# EAGLE design Eagle_4-Channel Relay Driver Circuit (EAGLE 9.6.2)
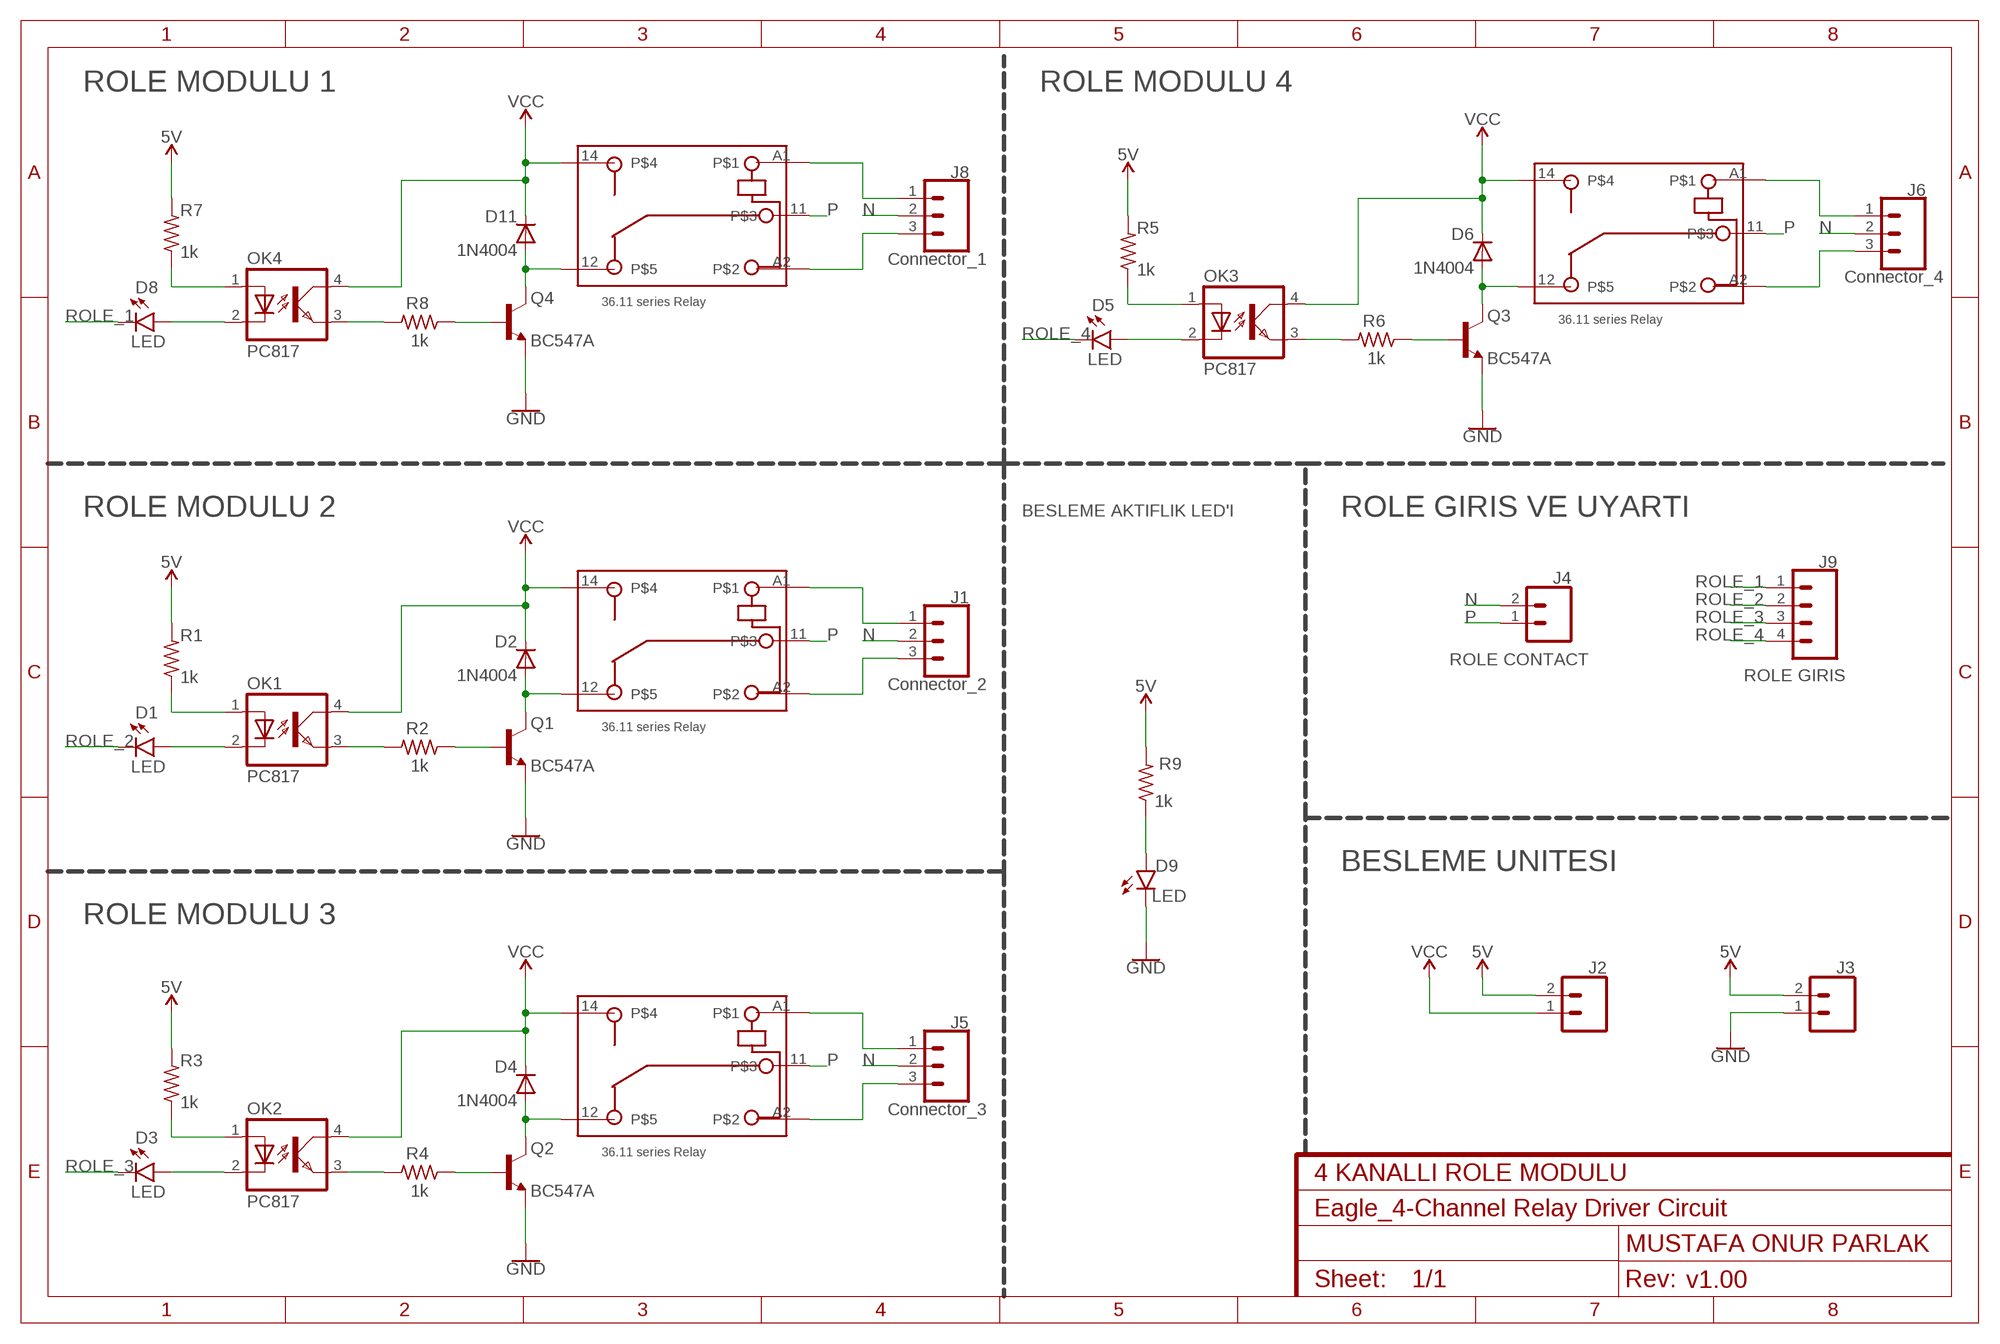
[diagram p0: schematic, sheet 1]
FRAME1 (FRAME-A4L): CNAME: 4 KANALLI ROLE MODULU; CREVISION: v1.00; DESIGNER: MUSTAFA ONUR PARLAK

## Parts
D1  LED  LED3MM  [LED_3MM]
D2  1N4004  [DO41-10]
D3  LED  LED3MM  [LED_3MM]
D4  1N4004  [DO41-10]
D5  LED  LED3MM  [LED_3MM]
D6  1N4004  [DO41-10]
D8  LED  LED3MM  [LED_3MM]
D9  LED  LED3MM  [LED_3MM]
D11  1N4004  [DO41-10]
J1  Connector_2  CONN_03  [1X03]
J2  CONN_02  [1X02]
J3  CONN_02  [1X02]
J4  ROLE CONTACT  CONN_02  [1X02]
J5  Connector_3  CONN_03  [1X03]
J6  Connector_4  CONN_03  [1X03]
J8  Connector_1  CONN_03  [1X03]
J9  ROLE GIRIS  CONN_04PTH  [1X04]
OK1  PC817  [DIL04]
OK2  PC817  [DIL04]
OK3  PC817  [DIL04]
OK4  PC817  [DIL04]
Q1  BC547A  TRANS_NPN-2N3904  [TO-92]
Q2  BC547A  TRANS_NPN-2N3904  [TO-92]
Q3  BC547A  TRANS_NPN-2N3904  [TO-92]
Q4  BC547A  TRANS_NPN-2N3904  [TO-92]
R1  1k  R-US_0207/10  [0207/10]
R2  1k  R-US_0207/10  [0207/10]
R3  1k  R-US_0207/10  [0207/10]
R4  1k  R-US_0207/10  [0207/10]
R5  1k  R-US_0207/10  [0207/10]
R6  1k  R-US_0207/10  [0207/10]
R7  1k  R-US_0207/10  [0207/10]
R8  1k  R-US_0207/10  [0207/10]
R9  1k  R-US_0207/10  [0207/10]
ROLE_1  36.11  [36.11]
ROLE_2  36.11  [36.11]
ROLE_3  36.11  [36.11]
ROLE_4  36.11  [36.11]

## Nets
5V: J2.2 J3.2 R1.2 R3.2 R5.2 R7.2 R9.2
GND: D9.K(C) J3.1 Q1.1(E) Q2.1(E) Q3.1(E) Q4.1(E)
N: J1.2 J4.2 J5.2 J6.2 J8.2
N$1: OK1.1(A) R1.1
N$2: Q1.2(B) R2.1
N$3: D2.A Q1.3(C) ROLE_2.12
N$4: D1.A OK1.2(C)
N$5: OK1.3(EMIT) R2.2
N$6: J1.1 ROLE_2.A1
N$7: J1.3 ROLE_2.A2
N$8: OK2.1(A) R3.1
N$9: Q2.2(B) R4.1
N$10: D4.A Q2.3(C) ROLE_3.12
N$11: D3.A OK2.2(C)
N$12: OK2.3(EMIT) R4.2
N$13: J5.1 ROLE_3.A1
N$14: J5.3 ROLE_3.A2
N$15: OK3.1(A) R5.1
N$16: Q3.2(B) R6.1
N$17: D6.A Q3.3(C) ROLE_4.12
N$18: D5.A OK3.2(C)
N$19: OK3.3(EMIT) R6.2
N$20: J6.1 ROLE_4.A1
N$21: J6.3 ROLE_4.A2
N$22: OK4.1(A) R7.1
N$23: Q4.2(B) R8.1
N$24: D11.A Q4.3(C) ROLE_1.12
N$25: D8.A OK4.2(C)
N$26: OK4.3(EMIT) R8.2
N$27: J8.1 ROLE_1.A1
N$28: J8.3 ROLE_1.A2
N$29: D9.A R9.1
P: J4.1 ROLE_1.11 ROLE_2.11 ROLE_3.11 ROLE_4.11
ROLE_1: D8.K(C) J9.1
ROLE_2: D1.K(C) J9.2
ROLE_3: D3.K(C) J9.3
ROLE_4: D5.K(C) J9.4
VCC: D2.C D4.C D6.C D11.C J2.1 OK1.4(COL) OK2.4(COL) OK3.4(COL) OK4.4(COL) ROLE_1.14 ROLE_2.14 ROLE_3.14 ROLE_4.14

## Notes on the sheet
- ROLE MODULU 1 | ROLE MODULU 4
- ROLE MODULU 2 | BESLEME AKTIFLIK LED'I | ROLE GIRIS VE UYARTI
- BESLEME UNITESI
- ROLE MODULU 3

## Library data of the parts
D1 D3 D5 D8 D9 = SparkFun-LED:LED: LED (Generic) Standard schematic elements and footprints for 5mm, 3mm, 1206, and 0603 sized LEDs. Generic LEDs with no color specified.; PROD_ID: DIO-08794
D2 D4 D6 D11 = diode-1:1N4004: DIODE general purpose rectifier, 1 A
J1 J5 J6 J8 = SparkFun-Connectors:CONN_03: Multi connection point. Often used as Generic Header-pin footprint for 0.1 inch spaced/style header connections On any of the 0.1 inch spaced packages, you can populate with these: Break Away Headers - Straight <https://www.sparkfun.com/products/116> (PRT-00116) Break Away Male Headers - Right Angle <https://www.sparkfun.com/products/553> (PRT-00553) Female Headers <https://www.sparkfun.com/products/115> (PRT-00115) Break Away Headers - Machine Pin <https://www.sparkfun.com/products/117> (PRT-00117) Break Away Female Headers - Swiss Machine Pin <https://www.sparkfun.com/products/743> (PRT-00743) Stackable Header - 3 Pin (Female, 0.1") <https://www.sparkfun.com/products/13875> (PRT-13875) For SCREWTERMINALS and SPRING TERMINALS visit here: Screw Terimnals on SparkFun.com <https://www.sparkfun.com/search/results?term=Screw+Terminals> (5mm/3.5mm/2.54mm spacing) This device is also useful as a general connection point to wire up your design to another part of your project. Our various solder wires solder well into these plated through hole pads. Hook-Up Wire - Assortment (Stranded, 22 AWG) <https://www.sparkfun.com/products/11375> (PRT-11375) Hook-Up Wire - Assortment (Solid Core, 22 AWG) <https://www.sparkfun.com/products/11367> (PRT-11367) View the entire wire category on our website here <https://www.sparkfun.com/categories/141> Special notes: Molex polarized connector foot print use with SKU : PRT-08232 with associated crimp pins and housings.; PROD_ID: XXX-00000; VALUE: 455-1750-1-ND
J2-J4 = SparkFun-Connectors:CONN_02: Multi connection point. Often used as Generic Header-pin footprint for 0.1 inch spaced/style header connections On any of the 0.1 inch spaced packages, you can populate with these: Break Away Headers - Straight <https://www.sparkfun.com/products/116> (PRT-00116) Break Away Male Headers - Right Angle <https://www.sparkfun.com/products/553> (PRT-00553) Female Headers <https://www.sparkfun.com/products/115> (PRT-00115) Break Away Headers - Machine Pin <https://www.sparkfun.com/products/117> (PRT-00117) Break Away Female Headers - Swiss Machine Pin <https://www.sparkfun.com/products/743> (PRT-00743) For SCREWTERMINALS and SPRING TERMINALS visit here: Screw Terimnals on SparkFun.com <https://www.sparkfun.com/search/results?term=Screw+Terminals> (5mm/3.5mm/2.54mm spacing) This device is also useful as a general connection point to wire up your design to another part of your project. Our various solder wires solder well into these plated through hole pads. Hook-Up Wire - Assortment (Stranded, 22 AWG) <https://www.sparkfun.com/products/11375> (PRT-11375) Hook-Up Wire - Assortment (Solid Core, 22 AWG) <https://www.sparkfun.com/products/11367> (PRT-11367) View the entire wire category on our website here <https://www.sparkfun.com/categories/141> Special notes: Molex polarized connector foot print use with: PRT-08233 with associated crimp pins and housings. 2.54_SCREWTERM for use with PRT-10571. 3.5mm Screw Terminal footprints for PRT-08084 5mm Screw Terminal footprints for use with PRT-08432
J9 = SparkFun-Connectors:CONN_04: Multi connection point. Often used as Generic Header-pin footprint for 0.1 inch spaced/style header connections On any of the 0.1 inch spaced packages, you can populate with these: Break Away Headers - Straight <https://www.sparkfun.com/products/116> (PRT-00116) Break Away Male Headers - Right Angle <https://www.sparkfun.com/products/553> (PRT-00553) Female Headers <https://www.sparkfun.com/products/115> (PRT-00115) Break Away Headers - Machine Pin <https://www.sparkfun.com/products/117> (PRT-00117) Break Away Female Headers - Swiss Machine Pin <https://www.sparkfun.com/products/743> (PRT-00743) For SCREWTERMINALS and SPRING TERMINALS visit here: Screw Terimnals on SparkFun.com <https://www.sparkfun.com/search/results?term=Screw+Terminals> (5mm/3.5mm/2.54mm spacing) This device is also useful as a general connection point to wire up your design to another part of your project. Our various solder wires solder well into these plated through hole pads. Hook-Up Wire - Assortment (Stranded, 22 AWG) <https://www.sparkfun.com/products/11375> (PRT-11375) Hook-Up Wire - Assortment (Solid Core, 22 AWG) <https://www.sparkfun.com/products/11367> (PRT-11367) View the entire wire category on our website here <https://www.sparkfun.com/categories/141> Special notes: Molex polarized connector foot print use with SKU : PRT-08231 with associated crimp pins and housings. 1MM SMD Version SKU: PRT-10208; PROD_ID: CONN-09696
OK1-OK4 = optocoupler-2:PC817: SHARP OPTO COUPLER
Q1-Q4 = SparkFun-DiscreteSemi:TRANS_NPN: NPN transistor Current controlled devices typically used to amplify current or used as a switch. BC547 - COM-08928 <http://www.sparkfun.com/products/8928> (TO-92 45V 100mA) (1.Collector 2.Base 3.Emitter) 2N3904 - COM-00521 <http://www.sparkfun.com/products/521> (TO-92 40V 200mA) (1.Emitter 2.Base 3.Collector) P2N2222A - COM-12852 <http://www.sparkfun.com/products/12852> (TO-92 40V 600mA) (1.Collector 2.Base 3.Emitter); PROD_ID: TRANS-08447; VALUE: 200mA/40V
R1-R9 = adafruit:R-US_: RESISTOR, American symbol
ROLE_1-ROLE_4 = relay_finder_36_11:36.11: Printed circuit mount miniature 10 A relay one pole changeover contacts Conform RoHS

## Board
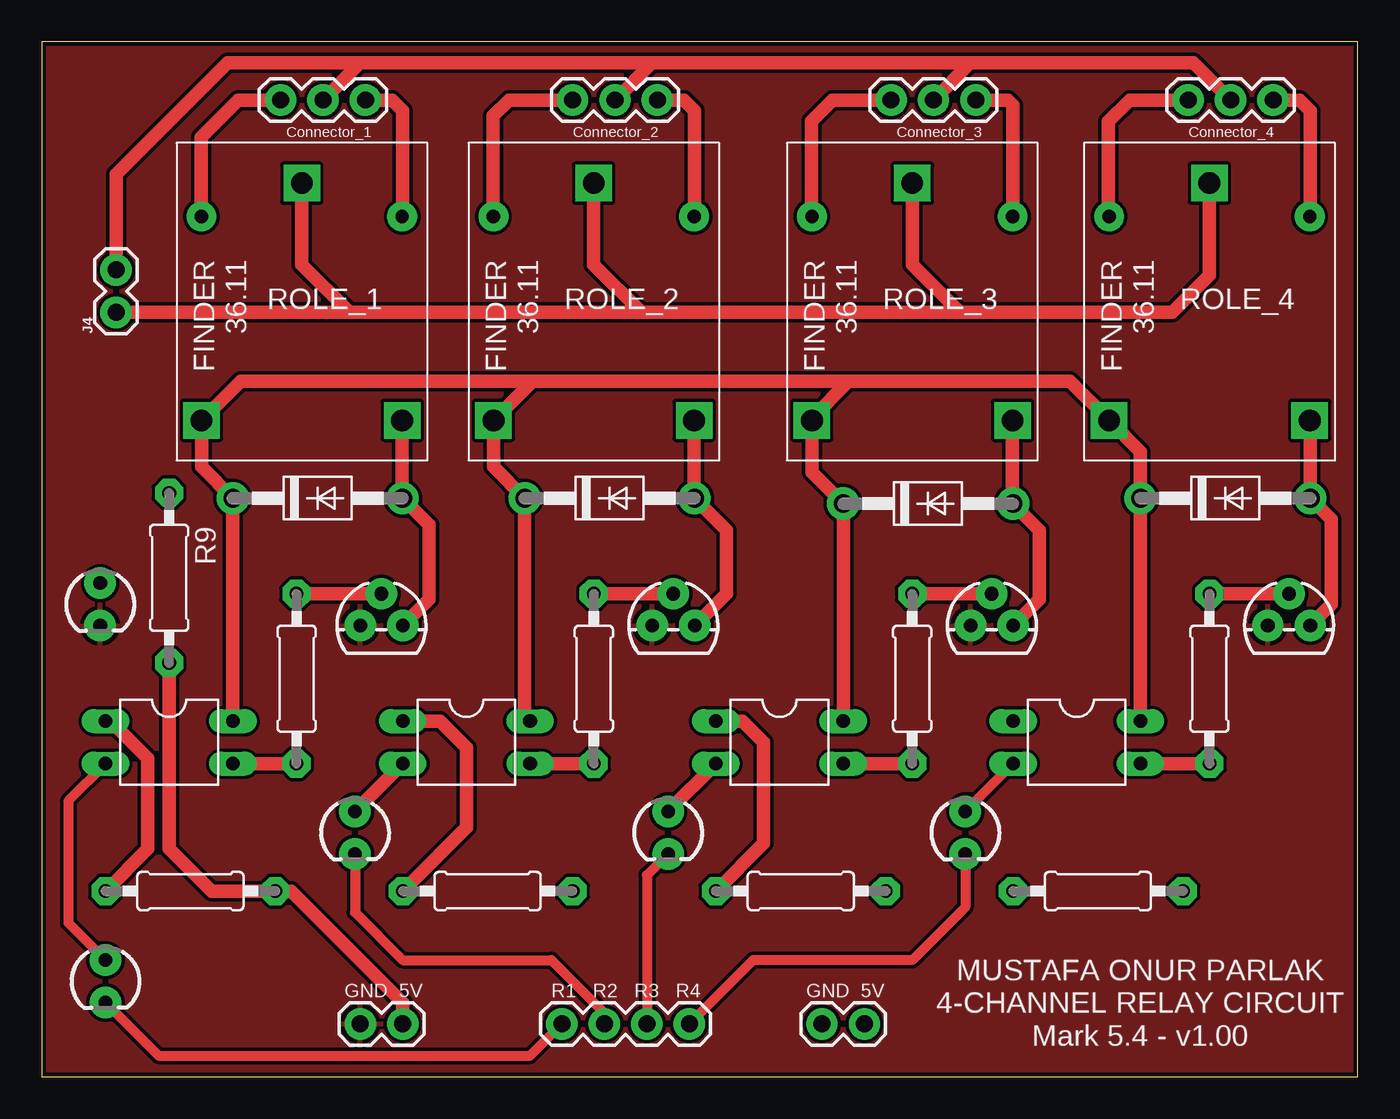
[diagram p1: board, top side]
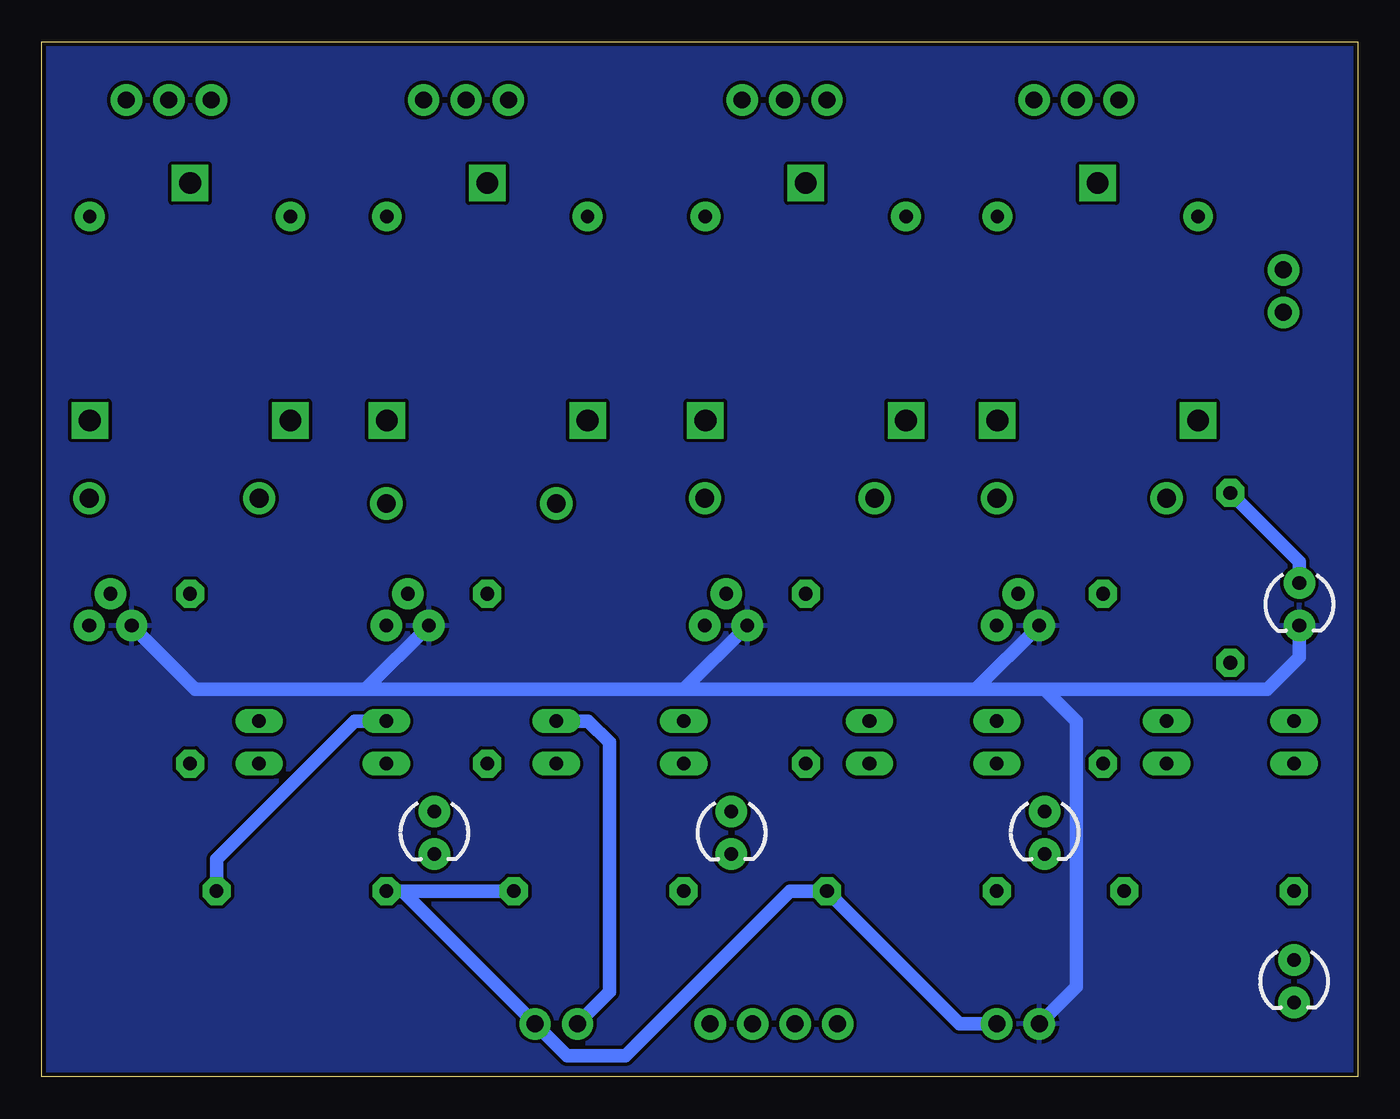
[diagram p2: board, bottom side, seen from below]

Size 78.72 x 61.9 mm. Coordinates in mm from the lower left corner, seen from the top.
Outline: 0,0 78.72,0 78.72,61.9 0,61.9 0,0
Copper layers (1*16): Top 0.035mm / dielectric 1.5mm / Bottom 0.035mm
Design rules "SparkFun": minimum track width 8mil, minimum drill 20mil, track to track 8mil, track to pad 8mil, pad to pad 8mil, via to via 8mil, smd to smd 8mil, copper to edge 10mil, drill to drill 8mil, minimum pad ring 12mil, minimum via ring 10mil, stop-mask expansion 4mil, vias tented up to drill 25mil, thermal gap 10mil

### Footprints (pad centres in the part's own frame; a part is rotated, then mirrored left to right if it is on the bottom)
LED_3MM = drill 0.813 pad 1.88: A -1.27,0; K 1.27,0
DO41-10 = drill 1.118 pad 1.93: A 5.08,0; C -5.08,0
1X03 = drill 1.016 pad 1.88: 1 0,0; 2 2.54,0; 3 5.08,0
1X02 = drill 1.016 pad 1.88: 1 0,0; 2 2.54,0
1X04 = drill 1.016 pad 1.88: 1 0,0; 2 2.54,0; 3 5.08,0; 4 7.62,0
DIL04 = drill 0.813 long: 1 -1.27,-3.81; 2 1.27,-3.81; 3 1.27,3.81; 4 -1.27,3.81
TO-92 = drill 0.813 pad 1.88: 1 -1.27,0; 2 0,1.905; 3 1.27,0
0207/10 = drill 0.813 pad 1.676 octagon: 1 -5.08,0; 2 5.08,0
36.11 = drill 1.3 pad 2.184 square: 11 -7.1,0; 12 7.1,6; 14 7.1,-6 | drill 0.8 pad 1.778: A1 -5.1,-6; A2 -5.1,6

### Placement (x,y rotation side)
D1  18.73,14.61 270 top
D2  33.97,34.61 0 top
D3  37.47,14.61 270 top
D4  53.02,34.29 0 top
D5  55.25,14.61 270 top
D6  70.8,34.61 0 top
D8  3.81,5.72 270 top
D9  3.49,28.26 270 top
D11  16.51,34.61 0 top
J1  31.75,58.42 0 top
J2  46.67,3.17 0 top
J3  19.05,3.17 0 top
J4  4.45,45.72 90 top
J5  50.8,58.42 0 top
J6  68.58,58.42 0 top
J8  14.29,58.42 0 top
J9  31.11,3.17 0 top
OK1  25.4,20 270 top
OK2  44.13,20 270 top
OK3  61.91,20 270 top
OK4  7.62,20 270 top
Q1  37.78,26.99 0 top
Q2  56.83,26.99 0 top
Q3  74.61,26.99 0 top
Q4  20.32,26.99 0 top
R1  26.67,11.11 0 top
R2  33.02,23.81 270 top
R3  45.4,11.11 0 top
R4  52.07,23.81 270 top
R5  63.18,11.11 180 top
R6  69.85,23.81 270 top
R7  8.89,11.11 0 top
R8  15.24,23.81 270 top
R9  7.62,29.84 270 top
ROLE_1  15.56,46.36 270 top
ROLE_2  33.02,46.36 270 top
ROLE_3  52.07,46.36 270 top
ROLE_4  69.85,46.36 270 top

### Tracks (layer width: path | path; a pad name or v marks a point on that pad's centre or on a via)
5V
  Top 0.813: R9.2 7.62,13.65 10.16,11.11 R7.2 14.92,11.11 21.59,4.45 J3.2
  Bottom 0.813: J3.2 23.81,3.17 R1.2 33.97,11.11 43.81,1.27 47.31,1.27 J2.2 57.15,11.11 | R5.2 57.15,11.11 | 57.15,11.11 R3.2
GND
  Bottom 0.813: Q3.1 69.53,23.18 59.37,23.18 | 59.37,23.18 40.32,23.18 | 40.32,23.18 22.86,23.18 | 18.73,23.18 5.4,23.18 3.49,25.08 D9.K | 18.73,23.18 22.86,23.18 | Q2.1 59.37,23.18 | Q1.1 40.32,23.18 | Q4.1 22.86,23.18 | J3.1 16.83,5.4 16.83,21.27 18.73,23.18
  pour Top: -3.81,65.41 -3.81,-4.45 82.55,-4.45 82.55,65.41
  pour Bottom: -5.08,65.41 -5.08,-5.71 83.82,-5.71 83.82,66.67 -5.08,66.67
N
  Top 0.813: J4.2 4.45,53.97 11.11,60.64 19.05,60.64 | 19.05,60.64 36.51,60.64 | 36.51,60.64 55.56,60.64 | 55.56,60.64 68.9,60.64 J6.2 | J5.2 55.56,60.64 | J1.2 36.51,60.64 | J8.2 19.05,60.64
N$1
  Top 0.813: OK1.1 23.81,21.27 25.4,19.69 25.4,14.92 R1.1
N$2
  Top 0.813: Q1.2 R2.1
N$3
  Top 0.813: Q1.3 40.96,28.89 40.96,32.7 D2.A 39.02,34.64 ROLE_2.12
N$4
  Top 0.813: OK1.2 D1.A
N$5
  Top 0.813: R2.2 OK1.3
N$6
  Top 0.813: J1.1 27.94,58.42 26.99,57.47 26.99,51.49 ROLE_2.A1
N$7
  Top 0.813: J1.3 38.42,58.42 39.05,57.78 39.05,51.49 ROLE_2.A2
N$8
  Top 0.813: R3.1 43.18,13.97 43.18,20 41.91,21.27 OK2.1
N$9
  Top 0.813: Q2.2 R4.1
N$10
  Top 0.813: Q2.3 59.69,28.58 59.69,32.7 D4.A 58.07,34.32 ROLE_3.12
N$11
  Top 0.813: OK2.2 D3.A
N$12
  Top 0.813: R4.2 OK2.3
N$13
  Top 0.813: J5.1 47.31,58.42 46.04,57.15 46.04,51.49 ROLE_3.A1
N$14
  Top 0.813: J5.3 57.78,58.42 58.1,58.1 58.1,51.49 ROLE_3.A2
N$15
  Bottom 0.813: OK3.1 60.01,21.27 68.26,13.02 R5.1
N$16
  Top 0.813: Q3.2 R6.1
N$17
  Top 0.813: Q3.3 77.15,28.26 77.15,33.34 D6.A 75.88,39.22 ROLE_4.12
N$18
  Top 0.61: OK3.2 D5.A
N$19
  Top 0.813: OK3.3 R6.2
N$20
  Top 0.813: J6.1 65.09,58.42 63.82,57.15 63.82,51.49 ROLE_4.A1
N$21
  Top 0.813: J6.3 75.25,58.42 75.88,57.78 75.88,51.49 ROLE_4.A2
N$22
  Top 0.813: R7.1 6.35,13.65 6.35,19.05 4.13,21.27 OK4.1
N$23
  Top 0.813: Q4.2 R8.1
N$24
  Top 0.813: ROLE_1.12 21.56,34.64 D11.A 23.18,33.02 23.18,28.58 Q4.3
N$25
  Top 0.61: OK4.2 1.59,16.51 1.59,9.21 D8.A
N$26
  Top 0.813: R8.2 OK4.3
N$27
  Top 0.813: J8.1 11.75,58.42 9.52,56.2 9.52,51.49 ROLE_1.A1
N$28
  Top 0.813: J8.3 20.95,58.42 21.59,57.78 21.59,51.49 ROLE_1.A2
N$29
  Bottom 0.813: D9.A 3.49,30.8 R9.1
P
  Top 0.813: J4.1 18.41,45.72 | 18.41,45.72 35.88,45.72 | 35.88,45.72 54.93,45.72 | 54.93,45.72 67.63,45.72 69.85,47.94 ROLE_4.11 | ROLE_3.11 52.07,48.58 54.93,45.72 | ROLE_2.11 33.02,48.58 35.88,45.72 | ROLE_1.11 15.56,48.58 18.41,45.72
ROLE_1
  Top 0.61: D8.K 6.98,1.27 29.21,1.27 J9.1
ROLE_2
  Top 0.61: D1.K 18.73,9.84 21.59,6.98 30.48,6.98 33.66,3.81 J9.2
ROLE_3
  Top 0.61: D3.K 36.19,12.06 J9.3
ROLE_4
  Top 0.61: D5.K 55.25,10.16 52.07,6.98 42.55,6.98 J9.4
VCC
  Top 0.813: 48.26,41.59 61.51,41.59 ROLE_4.14 65.72,37.38 D6.C OK3.4 | 48.26,41.59 29.36,41.59 | 29.36,41.59 ROLE_2.14 27.02,36.48 D2.C 28.89,21.59 OK1.4 | 48.26,41.59 46.07,39.4 ROLE_3.14 46.07,36.16 D4.C OK2.4 | 29.36,41.59 11.89,41.59 ROLE_1.14 9.56,36.48 D11.C OK4.4
  Bottom 0.813: J2.1 44.77,5.08 44.77,20 46.04,21.27 OK2.4

### Text on the board
tPlace: Connector_1 | Connector_2 | Connector_3 | Connector_4 | GND 5V | R1 R2 R3 R4 | GND 5V | MUSTAFA ONUR PARLAK / 4-CHANNEL RELAY CIRCUIT / Mark 5.4 - v1.00